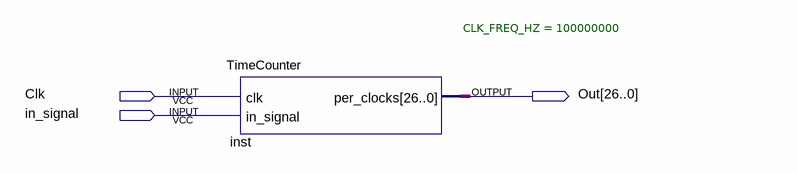
[diagram p0: schematic sheet]
// Quartus schematic Contador.bdf as structural Verilog: 1 symbols, 3 pins
module Contador (
  input  Clk,
  input  in_signal,
  output [26:0] Out
);

  TimeCounter #(.CLK_FREQ_HZ(100000000)) inst (.clk(Clk), .in_signal(in_signal), .per_clocks(Out));
endmodule
